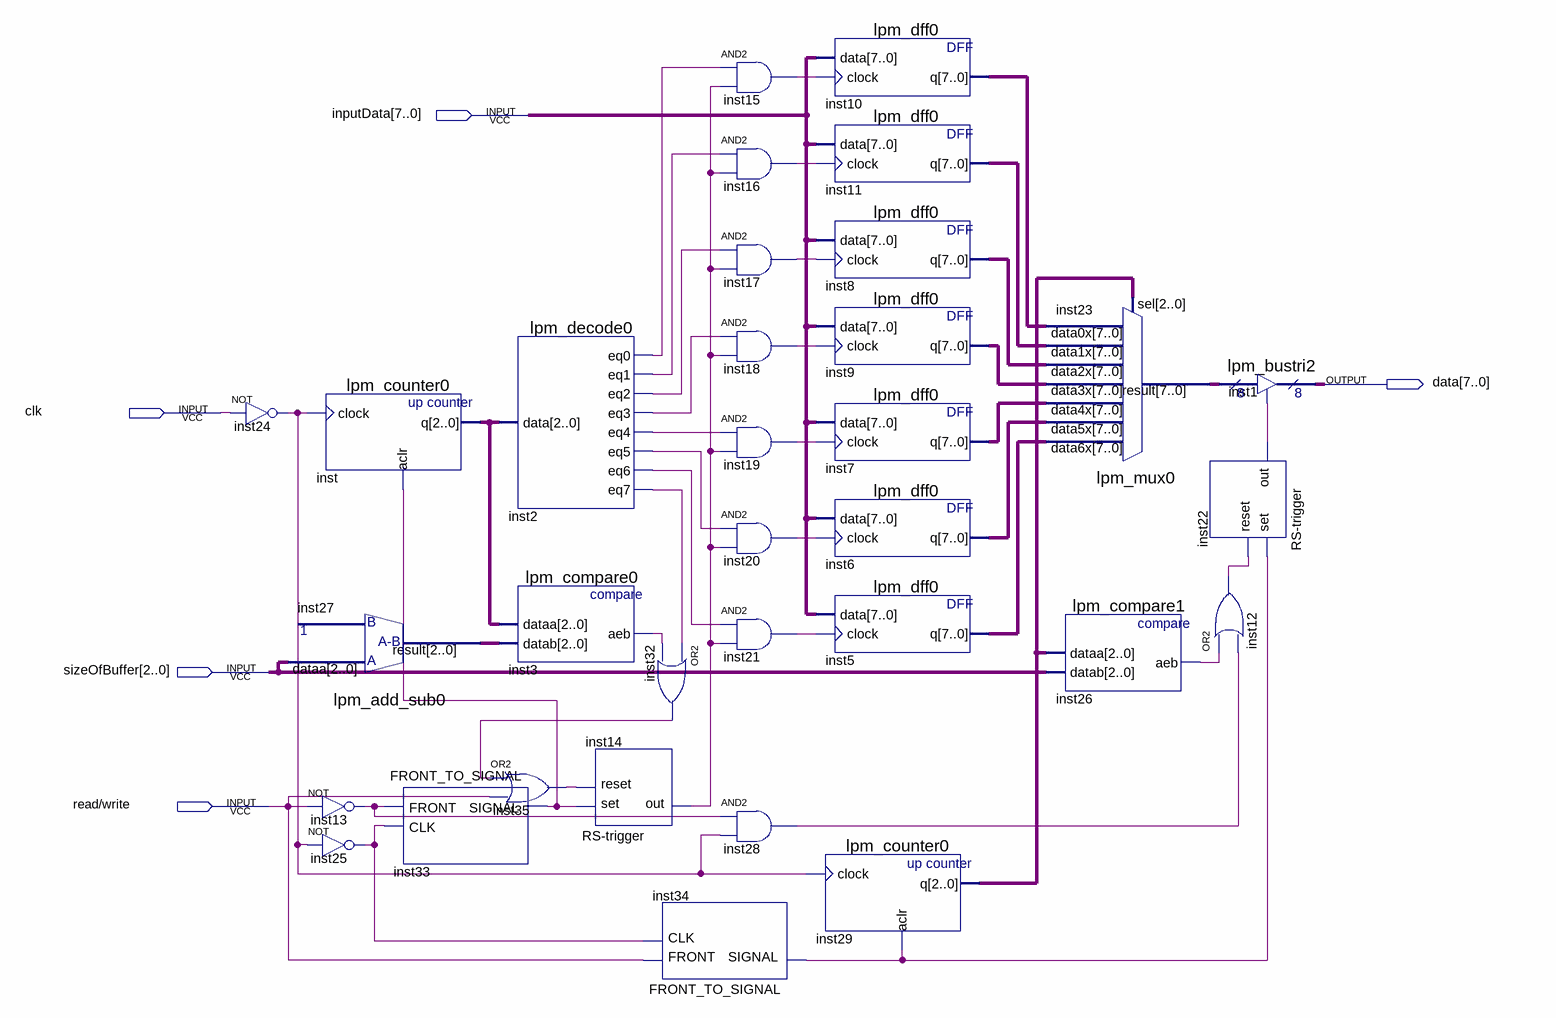
[diagram p0: schematic sheet]
// Quartus schematic Buffer.bdf as structural Verilog: 33 symbols, 5 pins
module Buffer (
  input  [7:0] inputData,
  input  clk,
  input  [2:0] sizeOfBuffer,
  input  \read/write ,
  output [7:0] data
);

  wire inst2_eq0, inst2_eq1, inst2_eq2, inst2_eq3, inst2_eq4, inst2_eq5, inst2_eq6, inst2_eq7, inst3_aeb,
       inst12_out, inst13_out, inst14_out, inst15_out, inst16_out, inst17_out, inst18_out, inst19_out,
       inst20_out, inst21_out, inst22_out, inst24_out, inst25_out, inst26_aeb, inst28_out, inst32_out,
       inst33_signal, inst34_signal, inst35_out;
  wire [2:0] inst27_result, inst29_q, inst_q;
  wire [7:0] inst5_q, inst6_q, inst7_q, inst8_q, inst9_q, inst10_q, inst11_q, inst23_result;

  not inst24 (inst24_out, clk);
  lpm_counter0 inst (.clock(inst24_out), .aclr(inst33_signal), .q(inst_q));
  lpm_add_sub0 inst27 (.dataa(sizeOfBuffer), .result(inst27_result));
  not inst13 (inst13_out, \read/write );
  not inst25 (inst25_out, inst24_out);
  FRONT_TO_SIGNAL inst33 (.FRONT(inst13_out), .CLK(inst25_out), .SIGNAL(inst33_signal));
  lpm_decode0 inst2 (
    .data(inst_q), .eq0(inst2_eq0), .eq1(inst2_eq1), .eq2(inst2_eq2), .eq3(inst2_eq3), .eq4(inst2_eq4),
    .eq5(inst2_eq5), .eq6(inst2_eq6), .eq7(inst2_eq7));
  lpm_compare0 inst3 (.dataa(inst_q), .datab(inst27_result), .aeb(inst3_aeb));
  or inst35 (inst35_out, inst32_out, \read/write );
  \RS-trigger  inst14 (.set(inst33_signal), .reset(inst35_out), .out(inst14_out));
  or inst32 (inst32_out, inst2_eq7, inst3_aeb);
  FRONT_TO_SIGNAL inst34 (.FRONT(\read/write ), .CLK(inst25_out), .SIGNAL(inst34_signal));
  and inst15 (inst15_out, inst2_eq0, inst14_out);
  and inst16 (inst16_out, inst2_eq1, inst14_out);
  and inst17 (inst17_out, inst2_eq2, inst14_out);
  and inst18 (inst18_out, inst2_eq3, inst14_out);
  and inst19 (inst19_out, inst2_eq4, inst14_out);
  and inst20 (inst20_out, inst2_eq5, inst14_out);
  and inst21 (inst21_out, inst2_eq6, inst14_out);
  and inst28 (inst28_out, inst13_out, inst24_out);
  lpm_counter0 inst29 (.clock(inst24_out), .aclr(inst34_signal), .q(inst29_q));
  lpm_dff0 inst10 (.data(inputData), .clock(inst15_out), .q(inst10_q));
  lpm_dff0 inst11 (.data(inputData), .clock(inst16_out), .q(inst11_q));
  lpm_dff0 inst8 (.data(inputData), .clock(inst17_out), .q(inst8_q));
  lpm_dff0 inst9 (.data(inputData), .clock(inst18_out), .q(inst9_q));
  lpm_dff0 inst7 (.data(inputData), .clock(inst19_out), .q(inst7_q));
  lpm_dff0 inst6 (.data(inputData), .clock(inst20_out), .q(inst6_q));
  lpm_dff0 inst5 (.data(inputData), .clock(inst21_out), .q(inst5_q));
  lpm_mux0 inst23 (
    .data6x(inst5_q), .data5x(inst6_q), .data4x(inst7_q), .data3x(inst9_q), .data2x(inst8_q),
    .data1x(inst11_q), .data0x(inst10_q), .sel(inst29_q), .result(inst23_result));
  lpm_compare1 inst26 (.dataa(inst29_q), .datab(sizeOfBuffer), .aeb(inst26_aeb));
  \RS-trigger  inst22 (.set(inst34_signal), .reset(inst12_out), .out(inst22_out));
  lpm_bustri2 inst1 (.enabledt(inst22_out), .data(inst23_result), .tridata(data));
  or inst12 (inst12_out, inst26_aeb, inst28_out);
endmodule
